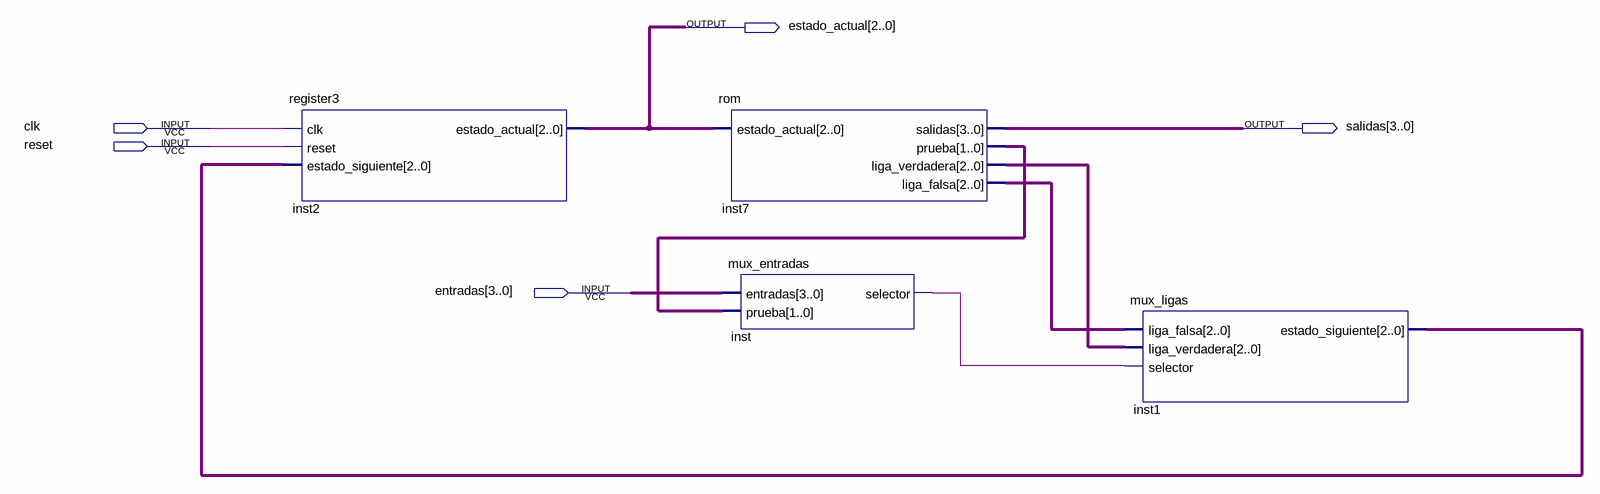
[diagram p0: schematic sheet]
// Quartus schematic practica3.bdf as structural Verilog: 4 symbols, 5 pins
module practica3 (
  input  clk,
  input  reset,
  input  [3:0] entradas,
  output [2:0] estado_actual,
  output [3:0] salidas
);

  wire inst_selector;
  wire [1:0] inst7_prueba;
  wire [2:0] inst1_estado_siguiente, inst7_liga_falsa, inst7_liga_verdadera;

  register3 inst2 (.clk(clk), .reset(reset), .estado_siguiente(inst1_estado_siguiente), .estado_actual(estado_actual));
  rom inst7 (
    .estado_actual(estado_actual), .salidas(salidas), .prueba(inst7_prueba),
    .liga_verdadera(inst7_liga_verdadera), .liga_falsa(inst7_liga_falsa));
  mux_entradas inst (.entradas(entradas), .prueba(inst7_prueba), .selector(inst_selector));
  mux_ligas inst1 (
    .liga_falsa(inst7_liga_falsa), .liga_verdadera(inst7_liga_verdadera), .selector(inst_selector),
    .estado_siguiente(inst1_estado_siguiente));
endmodule
